# EAGLE schematic Laser_Tag_Dip_New (EAGLE 6.0)
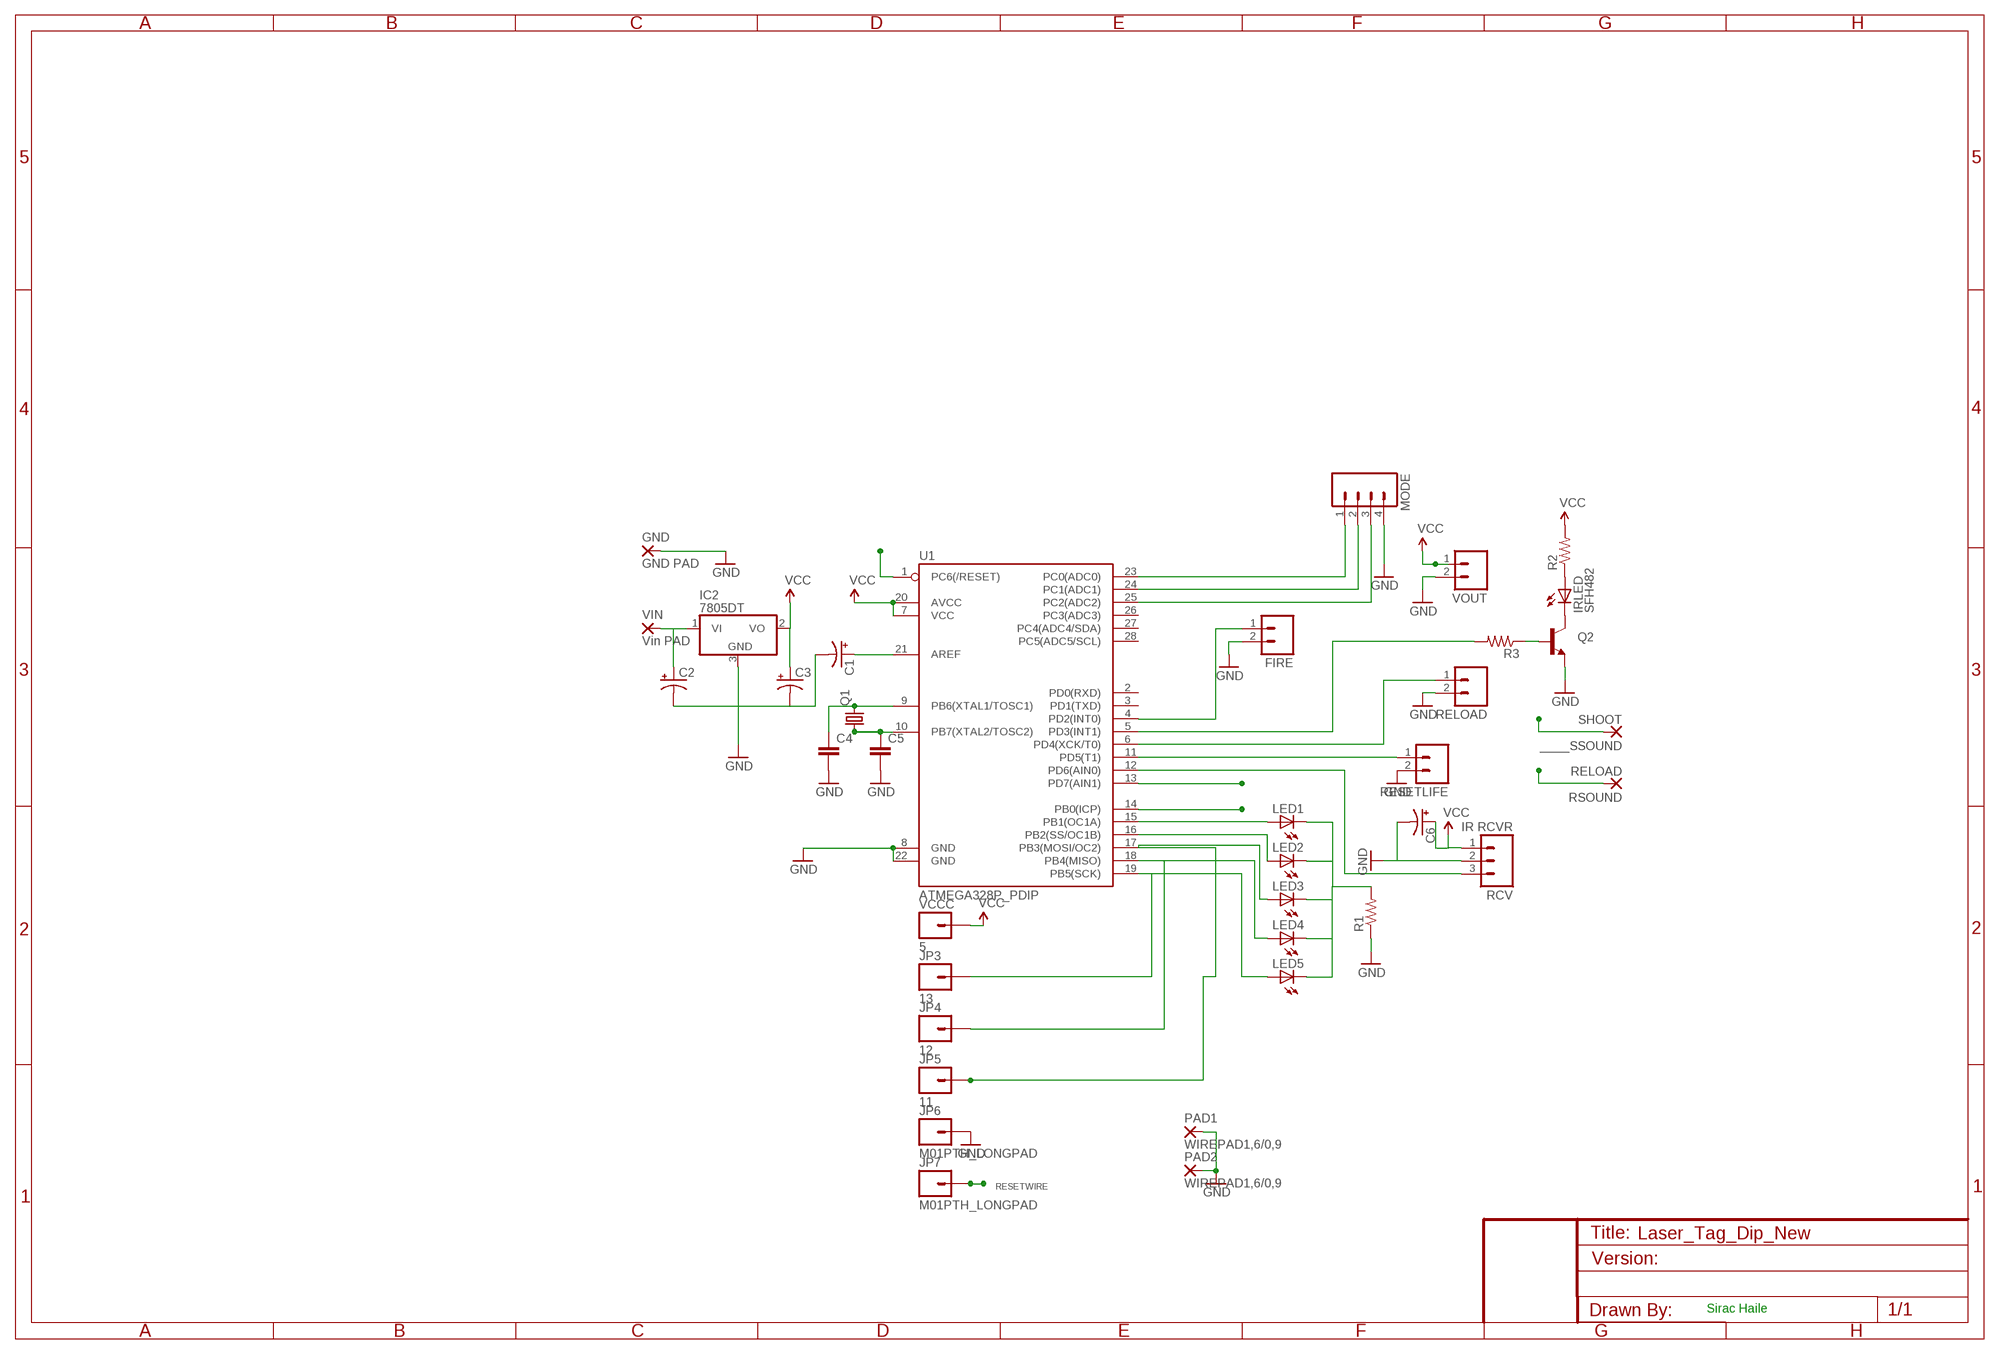
[diagram p0: schematic, sheet 1]

## Parts
____SSOUND  SHOOT  WIREPAD3,17/1,1  [3,17/1,1]
C1  CAP_POLPTH1  [CPOL-RADIAL-100UF-25V]
C2  CAP_POLPTH1  [CPOL-RADIAL-100UF-25V]
C3  CAP_POLPTH1  [CPOL-RADIAL-100UF-25V]
C4  CAPEZ  [CAP-PTH-SMALLEZ]
C5  CAPEZ  [CAP-PTH-SMALLEZ]
C6  CAP_POLPTH1  [CPOL-RADIAL-100UF-25V]
FIRE  M02LOCK_LONGPADS  [1X02_LOCK_LONGPADS]
GND  GND PAD  WIREPAD2,54/1,1  [2,54/1,1]
IC2  7805DT  [TO252]
IRLED  SFH482  [SFH482]
JP3  13  M01PTH_LONGPAD  [1X01_LONGPAD]
JP4  12  M01PTH_LONGPAD  [1X01_LONGPAD]
JP5  11  M01PTH_LONGPAD  [1X01_LONGPAD]
JP6  M01PTH_LONGPAD  [1X01_LONGPAD]
JP7  M01PTH_LONGPAD  [1X01_LONGPAD]
LED1  LED5MM  [LED5MM]
LED2  LED5MM  [LED5MM]
LED3  LED5MM  [LED5MM]
LED4  LED5MM  [LED5MM]
LED5  LED5MM  [LED5MM]
MODE  M04LONGPADS  [1X04_LONGPADS]
PAD1  WIREPAD1,6/0,9  [1,6/0,9]
PAD2  WIREPAD1,6/0,9  [1,6/0,9]
Q1  CRYSTALHC49S  [HC49/S]
Q2  TRANSISTOR_NPNTO-92-AMMO  [TO-92-AMMO]
R1  RESISTORKIT  [AXIAL-0.3-KIT]
R2  RESISTORKIT  [AXIAL-0.3-KIT]
R3  RESISTORKIT  [AXIAL-0.3-KIT]
RCV  IR RCVR  M03PTH  [1X03]
RELOAD  M02LOCK_LONGPADS  [1X02_LOCK_LONGPADS]
RESETLIFE  M02LOCK_LONGPADS  [1X02_LOCK_LONGPADS]
RSOUND  RELOAD  WIREPAD3,17/1,1  [3,17/1,1]
U1  ATMEGA328P_PDIP  [DIL28-3]
VCCC  5  M01PTH_LONGPAD  [1X01_LONGPAD]
VIN  Vin PAD  WIREPAD2,54/1,1  [2,54/1,1]
VOUT  M02PTH3  [1X02_LONGPADS]

## Nets
CONNECT: FIRE.1 U1.4(PD2(INT0))
GND: C1.2(-) C2.2(-) C3.2(-) C4.2 C5.2 C6.2(-) FIRE.2 GND.1(P) IC2.3(GND) JP6.1 MODE.4 PAD1.1(P) PAD2.1(P) Q2.1(E) R1.P$1 RCV.2 RELOAD.2 RESETLIFE.2 U1.8(GND) U1.22(GND) VOUT.2
N$1: C2.1(+) IC2.1(VI) VIN.1(P)
N$2: C1.1(+) U1.21(AREF)
N$3: LED1.A U1.15(PB1(OC1A))
N$4: C5.1 Q1.1 U1.10(PB7(XTAL2/TOSC2))
N$5: LED2.A U1.16(PB2(SS/OC1B))
N$6: C4.1 Q1.2 U1.9(PB6(XTAL1/TOSC1))
N$7: JP5.1 LED3.A U1.17(PB3(MOSI/OC2))
N$8: JP4.1 LED4.A U1.18(PB4(MISO))
N$9: JP3.1 LED5.A U1.19(PB5(SCK))
N$10: LED1.K(C) LED2.K(C) LED3.K(C) LED4.K(C) LED5.K(C) R1.P$2
N$11: IRLED.K(C) Q2.3(C)
N$12: IRLED.A R2.P$1
N$13: RELOAD.1 U1.6(PD4(XCK/T0))
N$14: RESETLIFE.1 U1.11(PD5(T1))
N$15: RCV.3 U1.12(PD6(AIN0))
N$16: Q2.2(B) R3.P$1
N$17: MODE.1 U1.23(PC0(ADC0))
N$18: MODE.2 U1.24(PC1(ADC1))
N$19: MODE.3 U1.25(PC2(ADC2))
N$20: R3.P$2 U1.5(PD3(INT1))
N$21: U1.1(PC6(/RESET))
RELOADSOUND: RSOUND.1(P) U1.14(PB0(ICP))
RESETWIRE: JP7.1
SHOOTSOUND: ____SSOUND.1(P) U1.13(PD7(AIN1))
VCC: C3.1(+) C6.1(+) IC2.2(VO) R2.P$2 RCV.1 U1.7(VCC) U1.20(AVCC) VCCC.1 VOUT.1
Unconnected: U1.2(PD0(RXD)) U1.3(PD1(TXD)) U1.26(PC3(ADC3)) U1.27(PC4(ADC4/SDA)) U1.28(PC5(ADC5/SCL))

## Notes on the sheet
- Sirac Haile

## Library data of the parts
____SSOUND GND PAD1 PAD2 RSOUND VIN = wirepad:WIREPAD: Wire PAD connect wire on PCB
C1-C3 C6 = SparkFun-Capacitors:CAP_POL: Capacitor Polarized These are standard SMD and PTH capacitors. Normally 10uF, 47uF, and 100uF in electrolytic and tantalum varieties. Always verify the external diameter of the through hole cap, it varies with capacity, voltage, and manufacturer. The EIA devices should be standard.
C4 C5 = SparkFun-Capacitors:CAP: Capacitor Standard 0603 ceramic capacitor, and 0.1" leaded capacitor.
FIRE RELOAD RESETLIFE VOUT = SparkFun-Connectors:M02: Header 2 Standard 2-pin 0.1" header. Use with straight break away headers (SKU : PRT-00116), right angle break away headers (PRT-00553), swiss pins (PRT-00743), machine pins (PRT-00117), and female headers (PRT-00115). Molex polarized connector foot print use with SKU : PRT-08233 with associated crimp pins and housings.
IC2 = linear:78*: Positive VOLTAGE REGULATOR Source: http://cache.national.com/ds/LM/LM78L05.pdf http://www.fairchildsemi.com/ds/LM/LM7805.pdf
IRLED = led:SFH482: IR LED infrared emitting diode, Infineon
JP3-JP7 VCCC = SparkFun-Connectors:M01: Header 1 Standard 1-pin 0.1" header. Use with straight break away headers (SKU : PRT-00116), right angle break away headers (PRT-00553), swiss pins (PRT-00743), machine pins (PRT-00117), and female headers (PRT-00115).
LED1-LED5 = led:LED: LED OSRAM: - CHIPLED LG R971, LG N971, LY N971, LG Q971, LY Q971, LO R971, LY R971 LH N974, LH R974 LS Q976, LO Q976, LY Q976 LO Q996 - Hyper CHIPLED LW Q18S LB Q993, LB Q99A, LB R99A - SideLED LS A670, LO A670, LY A670, LG A670, LP A670 LB A673, LV A673, LT A673, LW A673 LH A674 LY A675 LS A676, LA A676, LO A676, LY A676, LW A676 LS A679, LY A679, LG A679 - Hyper Micro SIDELED® LS Y876, LA Y876, LO Y876, LY Y876 LT Y87S - SmartLED LW L88C, LW L88S LB L89C, LB L89S, LG L890 LS L89K, LO L89K, LY L89K LS L896, LA L896, LO L896, LY L896 - TOPLED LS T670, LO T670, LY T670, LG T670, LP T670 LSG T670, LSP T670, LSY T670, LOP T670, LYG T670 LG T671, LOG T671, LSG T671 LB T673, LV T673, LT T673, LW T673 LH T674 LS T676, LA T676, LO T676, LY T676, LB T676, LH T676, LSB T676, LW T676 LB T67C, LV T67C, LT T67C, LS T67K, LO T67K, LY T67K, LW E67C LS E67B, LA E67B, LO E67B, LY E67B, LB E67C, LV E67C, LT E67C LW T67C LS T679, LY T679, LG T679 LS T770, LO T770, LY T770, LG T770, LP T770 LB T773, LV T773, LT T773, LW T773 LH T774 LS E675, LA E675, LY E675, LS T675 LS T776, LA T776, LO T776, LY T776, LB T776 LHGB T686 LT T68C, LB T68C - Hyper Mini TOPLED® LB M676 - Mini TOPLED Santana® LG M470 LS M47K, LO M47K, LY M47K Source: http://www.osram.convergy.de LUXEON: - LUMILED® LXK2-PW12-R00, LXK2-PW12-S00, LXK2-PW14-U00, LXK2-PW14-V00 LXK2-PM12-R00, LXK2-PM12-S00, LXK2-PM14-U00 LXK2-PE12-Q00, LXK2-PE12-R00, LXK2-PE12-S00, LXK2-PE14-T00, LXK2-PE14-U00 LXK2-PB12-K00, LXK2-PB12-L00, LXK2-PB12-M00, LXK2-PB14-N00, LXK2-PB14-P00, LXK2-PB14-Q00 LXK2-PR12-L00, LXK2-PR12-M00, LXK2-PR14-Q00, LXK2-PR14-R00 LXK2-PD12-Q00, LXK2-PD12-R00, LXK2-PD12-S00 LXK2-PH12-R00, LXK2-PH12-S00 LXK2-PL12-P00, LXK2-PL12-Q00, LXK2-PL12-R00 Source: www.luxeon.com KINGBRIGHT: KA-3528ASYC Source: www.kingbright.com
MODE = SparkFun-Connectors:M04: Header 4 Standard 4-pin 0.1" header. Use with straight break away headers (SKU : PRT-00116), right angle break away headers (PRT-00553), swiss pins (PRT-00743), machine pins (PRT-00117), and female headers (PRT-00115). Molex polarized connector foot print use with SKU : PRT-08231 with associated crimp pins and housings. 1MM SMD Version SKU: PRT-10208
Q1 = crystal:CRYSTAL: CRYSTAL; OC_FARNELL: 1667008; OC_NEWARK: unknown
Q2 = SparkFun-DiscreteSemi:TRANSISTOR_NPN: Generic NPN BJT. MMBT2222 is the common NPN we use. Double check against datasheet- not all devices are the same!
R1 = SparkFun-Resistors:RESISTOR: Resistor Basic schematic elements and footprints for 0603, 1206, and PTH resistors.
R2 R3 = SparkFun-Passives:RESISTOR: Resistor Basic schematic elements and footprints for 0603, 1206, and PTH resistors.
RCV = SparkFun-Connectors:M03: Header 3 Standard 3-pin 0.1" header. Use with straight break away headers (SKU : PRT-00116), right angle break away headers (PRT-00553), swiss pins (PRT-00743), machine pins (PRT-00117), and female headers (PRT-00115). Molex polarized connector foot print use with SKU : PRT-08232 with associated crimp pins and housings.
U1 = SparkFun-DigitalIC:ATMEGA328P_PDIP: uC used in the Arduino 32kb flash, 1k EEPROM, 2k SRAM This is the through-hole version of this chip.

## Net classes
0 default: width 0.381 mm, drill 0.203 mm, clearance 0.254 mm